# Altium schematic sheet SNES_DRONE_GPIO.SchDoc
size A4
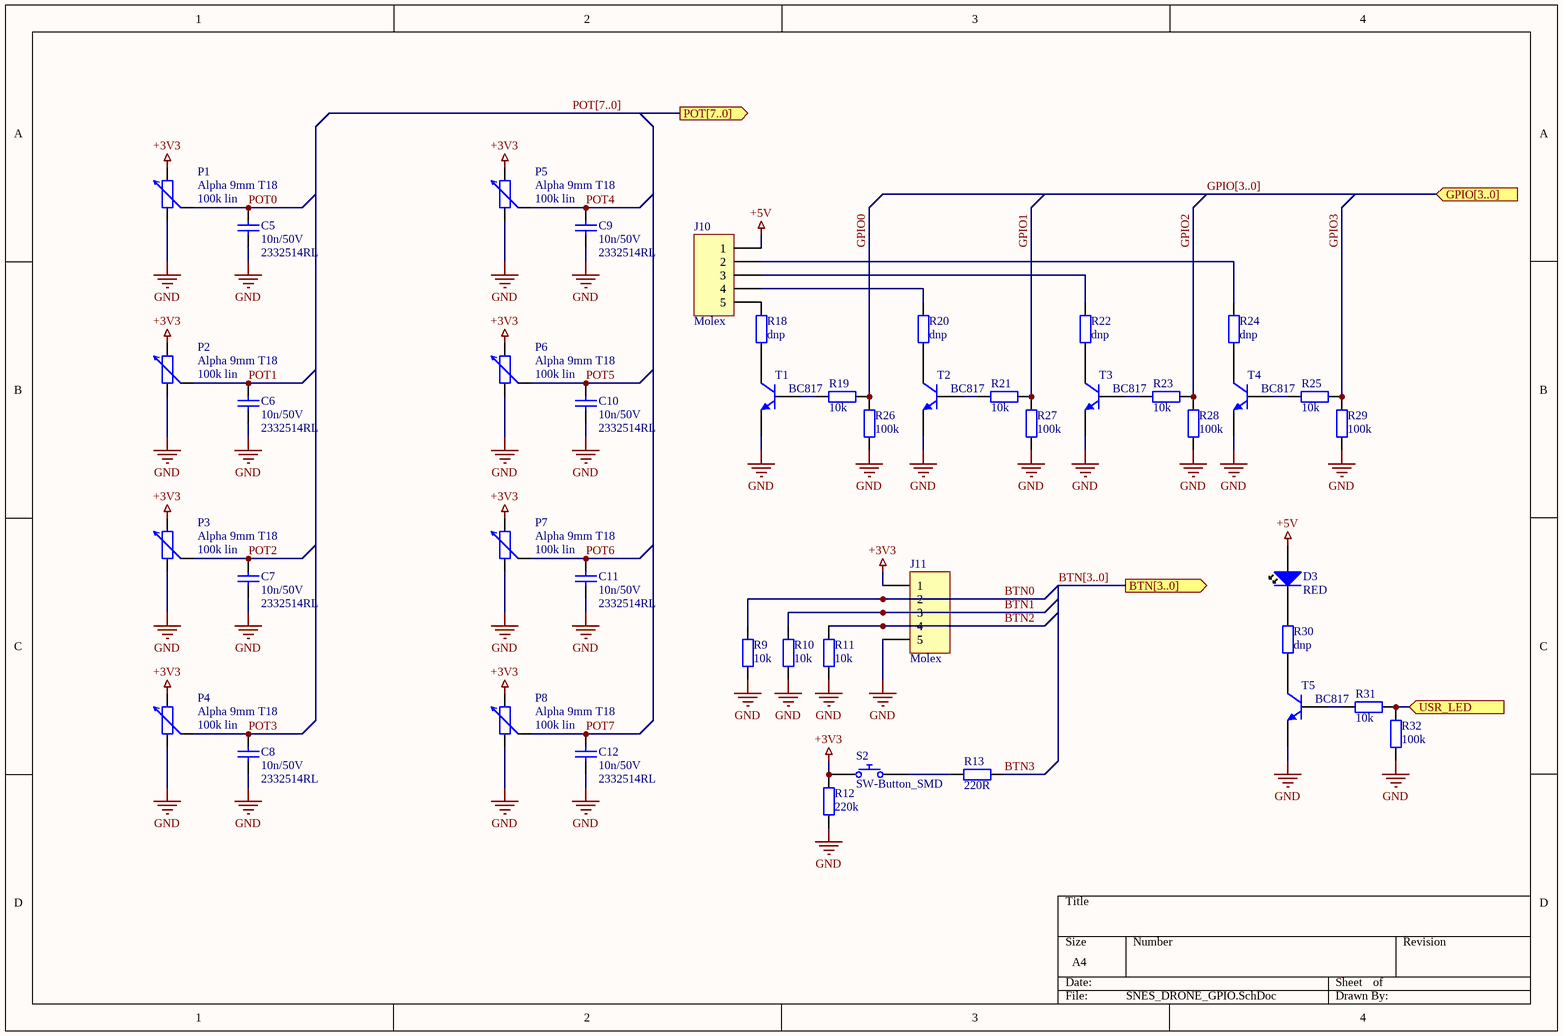
[diagram p0: SNES_DRONE_GPIO.SchDoc]

## Parts
C5  Supplier Part Number 1: 2332514RL  [0402_RES]  (hidden comment: 10n/50V)
C6  Supplier Part Number 1: 2332514RL  [0402_RES]  (hidden comment: 10n/50V)
C7  Supplier Part Number 1: 2332514RL  [0402_RES]  (hidden comment: 10n/50V)
C8  Supplier Part Number 1: 2332514RL  [0402_RES]  (hidden comment: 10n/50V)
C9  Supplier Part Number 1: 2332514RL  [0402_RES]  (hidden comment: 10n/50V)
C10  Supplier Part Number 1: 2332514RL  [0402_RES]  (hidden comment: 10n/50V)
C11  Supplier Part Number 1: 2332514RL  [0402_RES]  (hidden comment: 10n/50V)
C12  Supplier Part Number 1: 2332514RL  [0402_RES]  (hidden comment: 10n/50V)
D3  value RED  [0603_LED]  (hidden comment: RED LED)
J10  Manufacturer 1: Molex  [MOLEX_22-27-2051]  (hidden comment: MOLEX_22-27-2051)
J11  Manufacturer 1: Molex  [MOLEX_22-27-2051]  (hidden comment: MOLEX_22-27-2051)
P1  value 100k lin  Name: Alpha 9mm T18  [ALPHA_T18]  (hidden comment: RES_POT_100k_LIN_ALPHA_EURACK)
P2  value 100k lin  Name: Alpha 9mm T18  [ALPHA_T18]  (hidden comment: RES_POT_100k_LIN_ALPHA_EURACK)
P3  value 100k lin  Name: Alpha 9mm T18  [ALPHA_T18]  (hidden comment: RES_POT_100k_LIN_ALPHA_EURACK)
P4  value 100k lin  Name: Alpha 9mm T18  [ALPHA_T18]  (hidden comment: RES_POT_100k_LIN_ALPHA_EURACK)
P5  value 100k lin  Name: Alpha 9mm T18  [ALPHA_T18]  (hidden comment: RES_POT_100k_LIN_ALPHA_EURACK)
P6  value 100k lin  Name: Alpha 9mm T18  [ALPHA_T18]  (hidden comment: RES_POT_100k_LIN_ALPHA_EURACK)
P7  value 100k lin  Name: Alpha 9mm T18  [ALPHA_T18]  (hidden comment: RES_POT_100k_LIN_ALPHA_EURACK)
P8  value 100k lin  Name: Alpha 9mm T18  [ALPHA_T18]  (hidden comment: RES_POT_100k_LIN_ALPHA_EURACK)
R9  value 10k  [0603_RES]  (hidden comment: 10kOhm 100mW)
R10  value 10k  [0603_RES]  (hidden comment: 10kOhm 100mW)
R11  value 10k  [0603_RES]  (hidden comment: 10kOhm 100mW)
R12  value 220k  [0603_RES]  (hidden comment: 220kOhm 100mW)
R13  value 220R  [0603_RES]  (hidden comment: 220Ohm 100mW)
R18  DNP  [0603_DNP]  (no BOM)
R19  value 10k  [0603_RES]  (hidden comment: 10kOhm 100mW)
R20  DNP  [0603_DNP]  (no BOM)
R21  value 10k  [0603_RES]  (hidden comment: 10kOhm 100mW)
R22  DNP  [0603_DNP]  (no BOM)
R23  value 10k  [0603_RES]  (hidden comment: 10kOhm 100mW)
R24  DNP  [0603_DNP]  (no BOM)
R25  value 10k  [0603_RES]  (hidden comment: 10kOhm 100mW)
R26  value 100k  [0603_RES]  (hidden comment: 100kOhm 100mW)
R27  value 100k  [0603_RES]  (hidden comment: 100kOhm 100mW)
R28  value 100k  [0603_RES]  (hidden comment: 100kOhm 100mW)
R29  value 100k  [0603_RES]  (hidden comment: 100kOhm 100mW)
R30  DNP  [0603_DNP]  (no BOM)
R31  value 10k  [0603_RES]  (hidden comment: 10kOhm 100mW)
R32  value 100k  [0603_RES]  (hidden comment: 100kOhm 100mW)
S2  SW-Button_SMD  [SKQGAFE010]
T1  BC817  [TO-236AB]
T2  BC817  [TO-236AB]
T3  BC817  [TO-236AB]
T4  BC817  [TO-236AB]
T5  BC817  [TO-236AB]

## Ports
BTN[3..0] (out), GPIO[3..0] (in), POT[7..0] (out), USR_LED (in)

## Nets
+3V3: J11.1 P1.1 P2.1 P3.1 P4.1 P5.1 P6.1 P7.1 P8.1 R12.2 S2.3
+5V: D3.1(A) J10.1
GND: C5.1 C6.1 C7.1 C8.1 C9.1 C10.1 C11.1 C12.1 J11.5 P1.3 P2.3 P3.3 P4.3 P5.3 P6.3 P7.3 P8.3 R9.1 R10.1 R11.1 R12.1 R26.1 R27.1 R28.1 R29.1 R32.1 T1.2 T2.2 T3.2 T4.2 T5.2
BTN0: J11.2 R9.2
BTN1: J11.3 R10.2
BTN2: J11.4 R11.2
BTN3: R13.2
GPIO0: R19.1 R26.2
GPIO1: R21.1 R27.2
GPIO2: R23.1 R28.2
GPIO3: R25.1 R29.2
POT0: C5.2 P1.2
POT1: C6.2 P2.2
POT2: C7.2 P3.2
POT3: C8.2 P4.2
POT4: C9.2 P5.2
POT5: C10.2 P6.2
POT6: C11.2 P7.2
POT7: C12.2 P8.2
USR_LED: R31.1 R32.2 ; port USR_LED
NetD3_2: D3.2(K) R30.2
NetJ10_2: J10.2 R24.2
NetJ10_3: J10.3 R22.2
NetJ10_4: J10.4 R20.2
NetJ10_5: J10.5 R18.2
NetR13_1: R13.1 S2.1
NetR18_1: R18.1 T1.3
NetR19_2: R19.2 T1.1
NetR20_1: R20.1 T2.3
NetR21_2: R21.2 T2.1
NetR22_1: R22.1 T3.3
NetR23_2: R23.2 T3.1
NetR24_1: R24.1 T4.3
NetR25_2: R25.2 T4.1
NetR30_1: R30.1 T5.3
NetR31_2: R31.2 T5.1

## Buses and harness runs
bus BTN[3..0] = port BTN[3..0]
bus GPIO[3..0] = port GPIO[3..0]
bus POT[7..0] = port POT[7..0]

## Library data of the parts
C5-C12 = Cap_10n_0402: Keramikvielschichtkondensator, SMD, 10000 pF, 50 V, 0402 [Metrisch 1005], ± 10%, X7R, AVX 0402 MLCC; Manufacturer Part Number 1: 04025C103KAT2A; farnell number: 2332514; datasheet: http://www.farnell.com/datasheets/2237835.pdf?_ga=2.110684748.876692561.1541506444-1931041576.1541506444; Supplier Unit Price 1: 0,0689; Supplier Order Qty 1: 10; Supplier 1: Farnell; ComponentLink1Description: farnell; ComponentLink1URL: https://at.farnell.com/avx/04025c103kat2a/kondensator-0-01-f-50v-10-x7r/dp/2332514; ComponentLink2Description: datasheet; ComponentLink2URL: http://www.farnell.com/datasheets/2237835.pdf?_ga=2.156697970.876692561.1541506444-1931041576.1541506444; Manufacturer 1: AVX; Value: 10n/50V
D3 = LED_RED_0603: RED SMD 0603 LED 20mA 2V 0.04W; Manufacturer 1: KINGBRIGHT; Manufacturer Part Number 1: KPT-1608EC; farnell number: 2099221; datasheet: http://www.farnell.com/datasheets/2045911.pdf?_ga=2.71890899.197329085.1542397831-1931041576.1541506444; Supplier Order Qty 1: 5; Supplier Unit Price 1: 0,0686; Supplier 1: Farnell; ComponentLink1Description: datasheet; ComponentLink1URL: http://www.farnell.com/datasheets/2045911.pdf?_ga=2.71890899.197329085.1542397831-1931041576.1541506444; ComponentLink2Description: farnell; ComponentLink2URL: https://at.farnell.com/kingbright/kpt-1608ec/led-rot-0603-smd/dp/2099221; Supplier Part Number 1: 2099221RL
J10 J11 = MOLEX_22-27-2051: 5 pin molex connector; farnell number: 9731679; Supplier Unit Price 1: 0,271; datasheet: http://www.farnell.com/datasheets/2266141.pdf?_ga=2.175065506.1080119096.1514547302-1693477411.1514385574; Manufacturer Part Number 1: 22-27-2051; Supplier 1: Farnell; ComponentLink1Description: datasheet; ComponentLink1URL: http://www.farnell.com/datasheets/1861453.pdf?_ga=2.126244552.471268527.1516457893-947204359.1516457893; ComponentLink2Description: farnell; ComponentLink2URL: http://at.farnell.com/molex/22-27-2051/header-square-pin-0-1zoll-5way/dp/9731679?ost=9731679&ddkey=http%3Ade-AT%2FElement14_Austria%2Fsearch; Supplier Part Number 1: 9731679; Supplier Order Qty 1: 10; Value: *
P1-P8 = RES_POT_100k_LIN_ALPHA_EURACK: Shaft Diameter – 6mm (0.2″) / Shaft Length – 15mm (0.59″); Manufacturer 1: Alpha; Manufacturer Part Number 1: SP17090051; ComponentLink1Description: thonk; ComponentLink1URL: https://www.thonk.co.uk/shop/alpha-9mm-pots-vertical-t18/; Supplier 1: Thonk; Supplier Part Number 1: Alpha 9mm Pots; Supplier Order Qty 1: 1; Supplier Unit Price 1: 1,99; ComponentLink2Description: datasheet; ComponentLink2URL: https://www.thonk.co.uk/wp-content/uploads/2017/12/Alpha-9mm-Vertical-T18-RD901F-40-15K-B50K-0057.pdf
R9-R11 R19 R21 R23 R25 R31 = RES_0603_10k_100mW: YAGEO 10kOhm 100mW ± 1%; Manufacturer Part Number 1: RC0603JR-0710KL; Suppler Unit Price 1: 0,0195; Supplier Order Qty 1: 10; Supplier 1: Farnell; ComponentLink1Description: datasheet; ComponentLink1URL: http://www.farnell.com/datasheets/2167052.pdf?_ga=2.236107713.197329085.1542397831-1931041576.1541506444; ComponentLink2Description: farnell; ComponentLink2URL: https://at.farnell.com/yageo/rc0603jr-0710kl/dickschichtwiderstand-10k-5-0/dp/9233504; Supplier Part Number 1: 9233504RL; Manufacturer 1: YAGEO
R12 = RES_0603_220k_100mW: VISHAY 220kOhm 100mW ± 1%; Manufacturer Part Number 1: CRCW0603220KFKEA; Suppler Unit Price 1: 0,021; Supplier Order Qty 1: 10; Supplier 1: Farnell; ComponentLink1Description: datasheet; ComponentLink1URL: http://www.farnell.com/datasheets/2310790.pdf?_ga=2.144355573.197329085.1542397831-1931041576.1541506444; ComponentLink2Description: farnell; ComponentLink2URL: https://at.farnell.com/vishay/crcw0603220kfkea/dickschichtwiderstand-220k-1-0/dp/1469783; Manufacturer 1: VISHAY; Supplier Part Number 1: 2122659
R13 = RES_0603_220_100mW: YAGEO 220Ohm 100mW ± 1%; Manufacturer Part Number 1: RC0603JR-07220RL; Suppler Unit Price 1: 0,053; Supplier Order Qty 1: 10; Supplier 1: Farnell; ComponentLink1Description: datasheet; ComponentLink1URL: http://www.farnell.com/datasheets/2167052.pdf?_ga=2.63044847.197329085.1542397831-1931041576.1541506444; ComponentLink2Description: farnell; ComponentLink2URL: https://at.farnell.com/yageo/rc0603jr-07220rl/dickschichtwiderstand-220r-5-0/dp/9233296; Manufacturer 1: YAGEO; Supplier Part Number 1: 9233296RL
R18 R20 R22 R24 R30 = RES_DNP: Value: dnp
R26-R29 R32 = RES_0603_100k_100mW: WALSIN 6.8kOhm 100mW 75 ± 1%; Manufacturer 1: YAGEO; Manufacturer Part Number 1: RC0603FR-13100KL; Suppler Unit Price 1: 0,0156; datasheet: http://www.farnell.com/datasheets/1960319.pdf?_ga=2.194175406.2061832810.1527062369-1851341051.1526919624; price: 0,0156; Supplier Order Qty 1: 1; Supplier 1: Farnell; ComponentLink1Description: farnell; ComponentLink1URL: http://at.farnell.com/yageo/rc0603fr-13100kl/dickschichtwiderstand-100k-1-0/dp/2309107?ost=2309107&scope=partnumberlookahead&exaMfpn=true&searchref=searchlookahead&ddkey=http%3Ade-AT%2FElement14_Austria%2Fw%2Fsearch; ComponentLink2Description: datasheet; ComponentLink2URL: http://www.farnell.com/datasheets/2167052.pdf?_ga=2.98118940.2061832810.1527062369-1851341051.1526919624; Supplier Part Number 1: 1799369
S2 = SW-Button_SMD: ALPS SMD Push Button; Supplier 1: Farnell; ComponentLink1Description: datasheet; ComponentLink1URL: http://www.farnell.com/datasheets/1582326.pdf?_ga=2.174774114.197329085.1542397831-1931041576.1541506444; ComponentLink2Description: farnell; ComponentLink2URL: https://at.farnell.com/alps/skqgafe010/taster-smd-0-98n-5-2x5-2mm/dp/2056843; Supplier Part Number 1: 2056843RL; Manufacturer 1: ALPS; Manufacturer Part Number 1: SKQGAFE010; Supplier Order Qty 1: 10; Supplier Unit Price 1: 0,544
T1-T5 = BJT_NPN_BC817: BJT, NPN, 45 V, 250 mW, 500 mA, 160 hFE; Manufacturer 1: NEXPERIA; Manufacturer Part Number 1: BC817-25,215; farnell number: 1081224; datasheet: http://www.farnell.com/datasheets/1913545.pdf?_ga=2.172501667.1080119096.1514547302-1693477411.1514385574; Supplier Order Qty 1: 5; Value: *; Supplier Unit Price 1: 0,123; ComponentLink1Description: datasheet; ComponentLink1URL: http://www.farnell.com/datasheets/699988.pdf?_ga=2.152104250.2061832810.1527062369-1851341051.1526919624; ComponentLink2Description: farnell; ComponentLink2URL: http://at.farnell.com/nexperia/bc817-25-215/bipolartransistor-npn-45v-0-5a/dp/1081224?ost=1081224&scope=partnumberlookahead&exaMfpn=true&searchref=searchlookahead&ddkey=http%3Ade-AT%2FElement14_Austria%2Fw%2Fsearch; Supplier 1: Farnell; Supplier Part Number 1: 2336779